# Altium schematic sheet PowerSupply.SchDoc
size A3
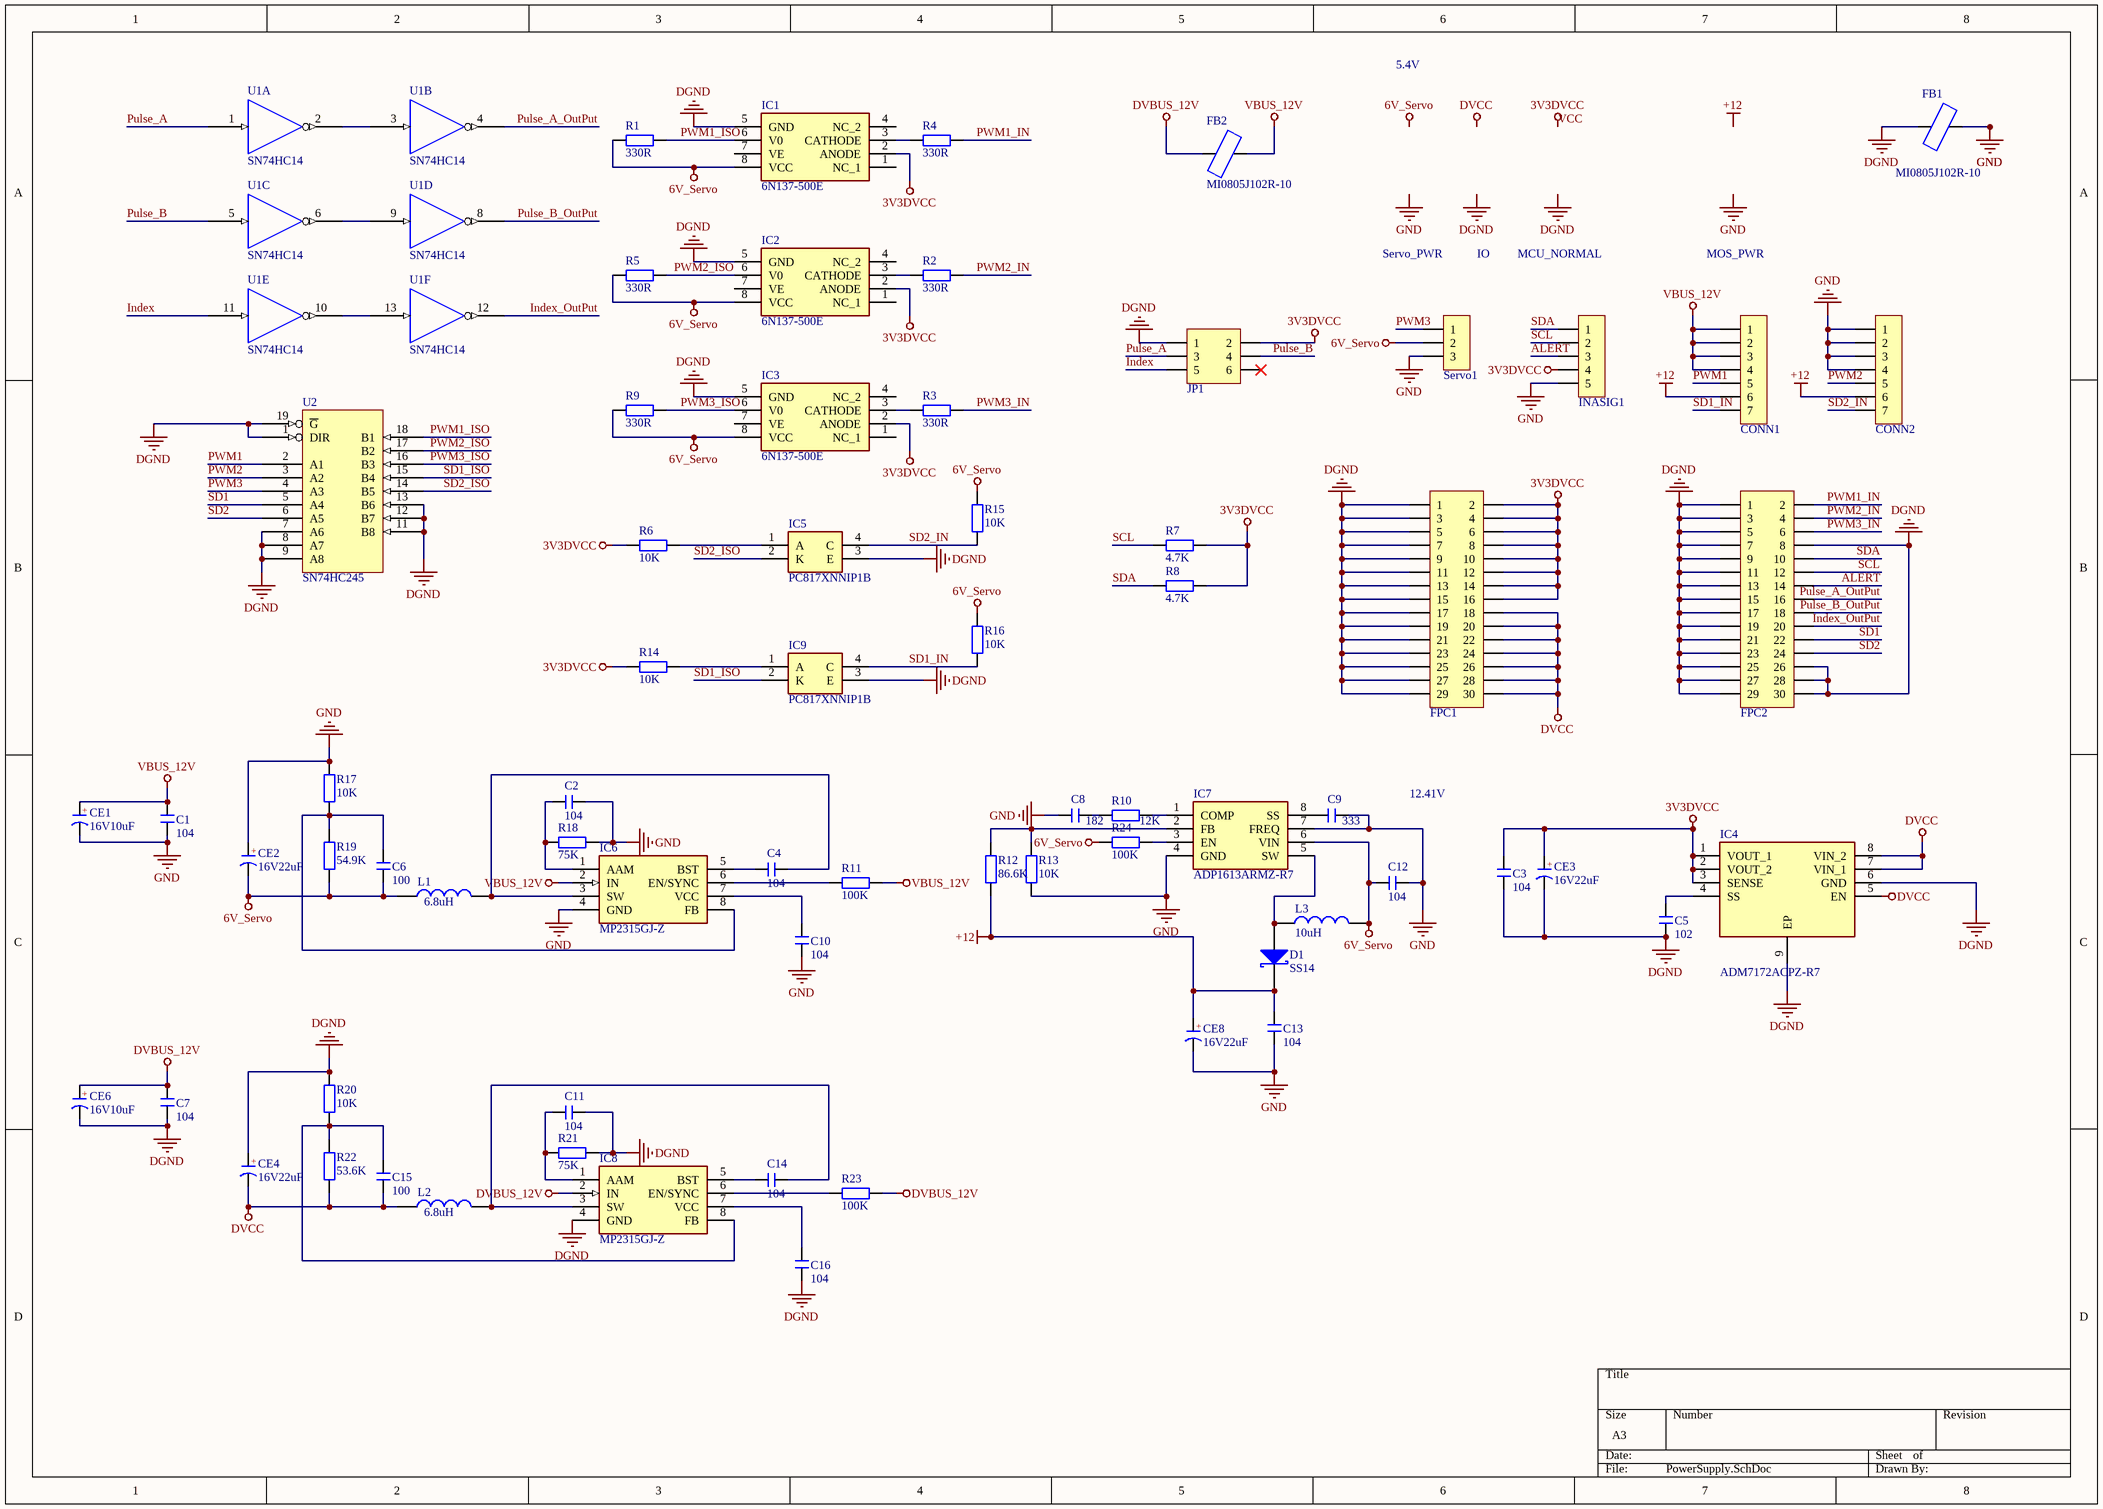
[diagram p0: PowerSupply.SchDoc]

## Parts
C1  104  [C 0805_L]
C2  104  [C 0805_L]
C3  104  [C 0805_L]
C4  104  [C 0805_L]
C5  102  [C 0805_L]
C6  100  [C 0805_L]
C7  104  [C 0805_L]
C8  182  [C 0805_L]
C9  333  [C 0805_L]
C10  104  [C 0805_L]
C11  104  [C 0805_L]
C12  104  [C 0805_L]
C13  104  [C 0805_L]
C14  104  [C 0805_L]
C15  100  [C 0805_L]
C16  104  [C 0805_L]
CE1  16V10uF  [C 1210_L]
CE2  16V22uF  [C 1210_L]
CE3  16V22uF  [C 1210_L]
CE4  16V22uF  [C 1210_L]
CE6  16V10uF  [C 1210_L]
CE8  16V22uF  [C 1210_L]
CONN1  HDR-1X7  [HDR2.54-LI-7P]  (value not drawn)
CONN2  HDR-1X7  [HDR2.54-LI-7P]  (value not drawn)
D1  SS14  [SMA]
FB1  MI0805J102R-10  [L 1206]
FB2  MI0805J102R-10  [L 1206]
FPC1  Header 2X11  [FPC0.5 2H-WS-30P]  (value not drawn)
FPC2  Header 2X11  [FPC0.5 2H-WS-30P]  (value not drawn)
IC1  6N137-500E  [SOP254P1030X508-8N]
IC2  6N137-500E  [SOP254P1030X508-8N]
IC3  6N137-500E  [SOP254P1030X508-8N]
IC4  ADM7172ACPZ-R7  [SON50P300X300X80-9N-D]
IC5  PC817XNNIP1B  [SOP254P960X420-4N]
IC6  MP2315GJ-Z  [SOT65P280X100-8N]
IC7  ADP1613ARMZ-R7  [SOP65P490X110-8N]
IC8  MP2315GJ-Z  [SOT65P280X100-8N]
IC9  PC817XNNIP1B  [SOP254P960X420-4N]
INASIG1  HDR-1X5  [HDR1X5]  (value not drawn)
JP1  Header3X2  [IDC2.54-LI-2x3P]  (value not drawn)
L1  6.8uH  [CDRH74]
L2  6.8uH  [CDRH74]
L3  10uH  [CDRH73]
R1  330R  [R 0805_L]
R2  330R  [R 0805_L]
R3  330R  [R 0805_L]
R4  330R  [R 0805_L]
R5  330R  [R 0805_L]
R6  10K  [R 0805_L]
R7  4.7K  [R 0805_M]
R8  4.7K  [R 0805_M]
R9  330R  [R 0805_L]
R10  12K  [R 0805_L]
R11  100K  [R 0805_L]
R12  86.6K  [R 0805_L]
R13  10K  [R 0805_L]
R14  10K  [R 0805_L]
R15  10K  [R 0805_L]
R16  10K  [R 0805_L]
R17  10K  [R 0805_L]
R18  75K  [R 0805_L]
R19  54.9K  [R 0805_L]
R20  10K  [R 0805_L]
R21  75K  [R 0805_L]
R22  53.6K  [R 0805_L]
R23  100K  [R 0805_L]
R24  100K  [R 0805_L]
Servo1  HDR-1X3  [HDR2.54-LI-3P]  (value not drawn)
U1  SN74HC14  [SOP14_M]  (parts A,B,C,D,E,F of 6)
U2  SN74HC245  [TSSOP-20]

## Nets
6V_Servo: C6.1 C12.1 CE2.2(K) IC1.8(VCC) IC2.8(VCC) IC3.8(VCC) IC7.6(VIN) L1.1 L3.2 R1.1 R5.1 R9.1 R15.2 R16.2 R19.1 R24.2 Servo1.2
+12: C13.2 CE8.1(A) CONN1.6 CONN2.6 D1.2(K) R12.1
DGND: C3.1 C5.1 C7.1 C11.2 C16.1 CE3.2(K) CE4.1(A) CE6.2(K) FB1.1 FPC1.2(29) FPC1.4(27) FPC1.6(25) FPC1.8(23) FPC1.10(21) FPC1.12(19) FPC1.14(17) FPC1.16(15) FPC1.18(13) FPC1.20(11) FPC1.22(9) FPC1.24(7) FPC1.26(5) FPC1.28(3) FPC1.30(1) FPC2.1(30) FPC2.2(29) FPC2.3(28) FPC2.4(27) FPC2.5(26) FPC2.6(25) FPC2.8(23) FPC2.10(21) FPC2.12(19) FPC2.14(17) FPC2.16(15) FPC2.18(13) FPC2.20(11) FPC2.22(9) FPC2.23(8) FPC2.24(7) FPC2.26(5) FPC2.28(3) FPC2.30(1) IC1.5(GND) IC2.5(GND) IC3.5(GND) IC4.6(GND) IC4.9(EP) IC5.3(E) IC8.4(GND) IC9.3(E) JP1.1 R20.2 R21.1 U2.1(DIR) U2.7(A6) U2.8(A7) U2.9(A8) U2.11(B8) U2.12(B7) U2.13(B6) U2.19(~{G})
DVBUS_12V: C7.2 CE6.1(A) FB2.1 IC8.2(IN) R23.1
DVCC: C15.1 CE4.2(K) FPC1.1(30) FPC1.3(28) FPC1.5(26) FPC1.7(24) FPC1.9(22) FPC1.11(20) FPC1.13(18) IC4.5(EN) IC4.7(VIN_1) IC4.8(VIN_2) L2.1 R22.1
GND: C1.1 C2.2 C8.1 C9.2 C10.1 C12.2 C13.1 CE1.2(K) CE2.1(A) CE8.2(K) CONN2.1 CONN2.2 CONN2.3 CONN2.4 FB1.2 IC6.4(GND) IC7.4(GND) IC7.7(FREQ) INASIG1.5 R13.1 R17.2 R18.1 Servo1.3 U1.7(DGND) U2.10(DGND)
VBUS_12V: C1.2 CE1.1(A) CONN1.1 CONN1.2 CONN1.3 CONN1.4 FB2.2 IC6.2(IN) R11.1
VCC: C3.2 CE3.1(A) FPC1.15(16) FPC1.17(14) FPC1.19(12) FPC1.21(10) FPC1.23(8) FPC1.25(6) FPC1.27(4) FPC1.29(2) IC1.2(ANODE) IC2.2(ANODE) IC3.2(ANODE) IC4.1(VOUT_1) IC4.2(VOUT_2) IC4.3(SENSE) INASIG1.4 JP1.2 R6.1 R7.1 R8.1 R14.1 U1.14(3V3DVCC) U2.20(3V3DVCC)  [also labelled 3V3DVCC]
ALERT: FPC2.17(14) INASIG1.3
Index: JP1.5 U1.11
Index_OutPut: FPC2.11(20) U1.12
Pulse_A: JP1.3 U1.1
Pulse_A_OutPut: FPC2.15(16) U1.4
Pulse_B: JP1.4 U1.5
Pulse_B_OutPut: FPC2.13(18) U1.8
PWM1: CONN1.5 U2.2(A1)
PWM1_IN: FPC2.29(2) R4.1
PWM1_ISO: IC1.6(V0) R1.2 U2.18(B1)
PWM2: CONN2.5 U2.3(A2)
PWM2_IN: FPC2.27(4) R2.1
PWM2_ISO: IC2.6(V0) R5.2 U2.17(B2)
PWM3: Servo1.1 U2.4(A3)
PWM3_IN: FPC2.25(6) R3.1
PWM3_ISO: IC3.6(V0) R9.2 U2.16(B3)
SCL: FPC2.19(12) INASIG1.2 R7.2
SD1: FPC2.9(22) U2.5(A4)
SD1_IN: CONN1.7 IC9.4(C) R16.1
SD1_ISO: IC9.2(K) U2.15(B4)
SD2: FPC2.7(24) U2.6(A5)
SD2_IN: CONN2.7 IC5.4(C) R15.1
SD2_ISO: IC5.2(K) U2.14(B5)
SDA: FPC2.21(10) INASIG1.1 R8.2
NetC2_1: C2.1 IC6.1(AAM) R18.2
NetC4_1: C4.1 IC6.5(BST)
NetC4_2: C4.2 IC6.3(SW) L1.2
NetC5_2: C5.2 IC4.4(SS)
NetC6_2: C6.2 IC6.8(FB) R17.1 R19.2
NetC8_2: C8.2 R10.1
NetC9_1: C9.1 IC7.8(SS)
NetC10_2: C10.2 IC6.7(VCC)
NetC11_1: C11.1 IC8.1(AAM) R21.2
NetC14_1: C14.1 IC8.5(BST)
NetC14_2: C14.2 IC8.3(SW) L2.2
NetC15_2: C15.2 IC8.8(FB) R20.1 R22.2
NetC16_2: C16.2 IC8.7(VCC)
NetD1_1: D1.1(A) IC7.5(SW) L3.1
NetIC1_3: IC1.3(CATHODE) R4.2
NetIC2_3: IC2.3(CATHODE) R2.2
NetIC3_3: IC3.3(CATHODE) R3.2
NetIC5_1: IC5.1(A) R6.2
NetIC6_6: IC6.6(EN/SYNC) R11.2
NetIC7_1: IC7.1(COMP) R10.2
NetIC7_2: IC7.2(FB) R12.2 R13.2
NetIC7_3: IC7.3(EN) R24.1
NetIC8_6: IC8.6(EN/SYNC) R23.2
NetIC9_1: IC9.1(A) R14.2
NetU1_2: U1.2 U1.3
NetU1_6: U1.6 U1.9
NetU1_10: U1.10 U1.13

Not connected (* = marked no-connect by the designer): IC1 1(NC_1) 4(NC_2) 7(VE); IC2 1(NC_1) 4(NC_2) 7(VE); IC3 1(NC_1) 4(NC_2) 7(VE); JP1 6*

## Notes on the sheet
- 5.4V
- Servo_PWR
- IO
- MCU_NORMAL
- MOS_PWR
- 12.41V
- Labels drawn without touching a wire or pin: 6V_Servo, +12, DGND, DVCC, GND
- (in symbol CE) +

## Library data of the parts
C1-C16 = C: 贴片电容; BOM名称: 无极性贴片电容; 淘宝ID: 封装库来自淘宝 ID：黄晶宝石; 联系售后，技术支持: https://shop463601444.taobao.com; 唯一出售店铺网址: https://shop463601444.taobao.com
CE1-CE4 CE6 CE8 = CE: 直插电解电容; 淘宝ID: 封装库来自淘宝 ID：黄晶宝石; BOM名称: 直插电解电容; 联系售后: https://shop463601444.taobao.com
CONN1 CONN2 = Header 7: 7P接插件; 版权归属: 封装库来自淘宝 ID：黄晶宝石; BOM名称: 7P接插件; 学习资源: https://shop463601444.taobao.com
D1 = SS14: 肖特基二极管; 属性: 40V/1A; BOM名称: 肖特基二极管; 封装库来自淘宝 ID：黄晶宝石: https://shop463601444.taobao.com
FB1 FB2 = FerriteBead: FERRITE BEAD 1 KOHM 0805 1LN; Mouser Part: 875-MI0805J102R-10; Digikey Part: 240-2551-1-ND
FPC1 FPC2 = Header 15X2: 15*2P接插件; 版权归属: 源创客; BOM名称: 15*2P接插件; 学习资源: www.ooocke.com
IC1-IC3 = 6N137-500E: Integrated Circuit; Manufacturer_Name: Avago Technologies; Datasheet Link: https://componentsearchengine.com//6N137-500E.pdf; Height: 4.7mm; Mouser2 Part Number: 630-6N137-500E; Mouser2 Price/Stock: https://www.mouser.com/Search/Refine.aspx?Keyword=630-6N137-500E; Manufacturer_Part_Number: 6N137-500E
IC4 = ADM7172ACPZ-R7: Integrated Circuit; Manufacturer_Name: Linear Technology; Datasheet Link: https://componentsearchengine.com/Datasheets/1/ADM7172ACPZ-R7.pdf; Height: 0.8mm; Manufacturer_Part_Number: ADM7172ACPZ-R7
IC5 IC9 = PC817XNNIP1B: Phototransistor; Manufacturer_Name: Sharp Microelectronics; Datasheet Link: https://componentsearchengine.com//PC817XNNIP1B.pdf; Height: 4.2mm; Mouser2 Part Number: 852-PC817XNNIP1B; Mouser2 Price/Stock: https://www.mouser.com/Search/Refine.aspx?Keyword=852-PC817XNNIP1B; Manufacturer_Part_Number: PC817XNNIP1B
IC6 IC8 = MP2315GJ-Z: Integrated Circuit; Manufacturer_Name: Monolithic Power Systems (MPS); Datasheet Link: https://componentsearchengine.com//MP2315GJ-Z.pdf; Height: 1mm; Mouser2 Part Number: 946-MP2315GJZ; Mouser2 Price/Stock: https://www.mouser.com/Search/Refine.aspx?Keyword=946-MP2315GJZ; Manufacturer_Part_Number: MP2315GJ-Z
IC7 = ADP1613ARMZ-R7: Integrated Circuit; Manufacturer_Name: Analog Devices; Datasheet Link: https://datasheet.lcsc.com/szlcsc/Analog-Devices-ADI-ADP1613ARMZ-R7_C132279.pdf; Height: 1.1mm; Manufacturer_Part_Number: ADP1613ARMZ-R7; Mouser Part Number: 584-ADP1613ARMZ-R7; Mouser Price/Stock: https://www.mouser.co.uk/ProductDetail/Analog-Devices/ADP1613ARMZ-R7/?qs=WIvQP4zGanhDtCwLTFW%252BRw%3D%3D; Arrow Part Number: ADP1613ARMZ-R7; Arrow Price/Stock: https://www.arrow.com/en/products/adp1613armz-r7/analog-devices
INASIG1 = Header 5: 5P接插件; 版权归属: 封装库来自淘宝 ID：黄晶宝石; BOM名称: 5P接插件; 学习资源: https://shop463601444.taobao.com
JP1 = Header 3X2: 3*2P接插件; 版权归属: 封装库来自淘宝 ID：黄晶宝石; BOM名称: 3*2P接插件; 学习资源: https://shop463601444.taobao.com
L1-L3 = L: 小功率贴片电感; 淘宝ID: 封装库来自淘宝 ID：黄晶宝石; 封装库来自淘宝卖家 ID：黄晶宝石: 其他店铺购入均为盗版，不享受售后技术支持服务，请立即申请退款; BOM名称: 小功率贴片电感; 联系售后: https://shop463601444.taobao.com
R1-R24 = R: 贴片电阻; 版权归属: 来自淘宝 ID：黄晶宝石; 封装库来自淘宝卖家 ID：黄晶宝石: 其他店铺购入均为盗版，不享受售后技术支持服务，请立即申请退款; BOM名称: 贴片电阻; 联系售后: https://shop463601444.taobao.com
Servo1 = Header 3: 3P接插件; 版权归属: 封装库来自淘宝 ID：黄晶宝石; BOM名称: 3P接插件; 学习资源: https://shop463601444.taobao.com
U1 = SN74HC14: Hex Inverter SCH
U2 = SN74HC245: QUAD BUS TRANSCEIVER 3SO